# Altium schematic sheet EEPROM.SchDoc
size A4; SheetNumber: 10; SheetTotal: 15
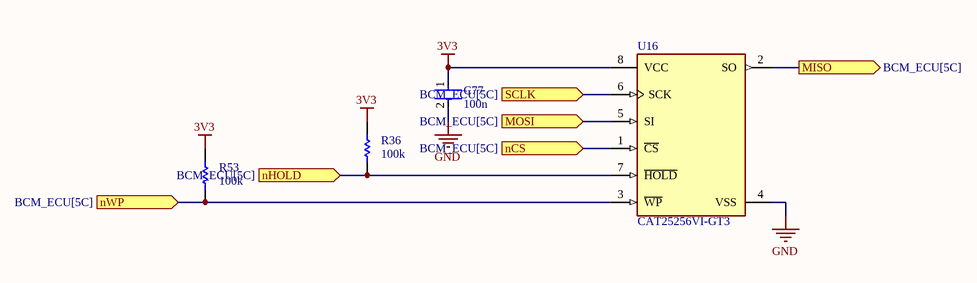
[diagram p0: EEPROM.SchDoc]

## Parts
C77  100n  [FP-0402-L_1_0_0_05-W_0_5-IPC_A]
R36  100k  [R0603B]
R53  100k  [R0603B]
U16  CAT25256VI-GT3  [FP-CAT25256VI-GT3-IPC_C]

## Ports
MISO (out, see BCM_ECU[5C]), MOSI (in, see BCM_ECU[5C]), nCS (in, see BCM_ECU[5C]), nHOLD (in, see BCM_ECU[5C]), nWP (in, see BCM_ECU[5C]), SCLK (in, see BCM_ECU[5C])

## Nets
3V3: C77.1 R36.2 R53.2 U16.8(VCC)
GND: C77.2 U16.4(VSS)
MISO: U16.2(SO) ; port MISO
MOSI: U16.5(SI) ; port MOSI
nCS: U16.1(~{CS}) ; port nCS
nHOLD: R36.1 U16.7(~{HOLD}) ; port nHOLD
nWP: R53.1 U16.3(~{WP}) ; port nWP
SCLK: U16.6(SCK) ; port SCLK

## Library data of the parts
C77 = CMP-001-00058-1: LARGE PADS, 0402 CAP, CHANGE COMMENT TO MATCH REAL P/N; Capacitor Type: Ceramic; Min Operating Temperature: -55°C; Mounting Technology: Surface Mount; Pins: 2; Case/Package: 0402; RoHS Compliant: Yes; Max Operating Temperature: 85°C
R36 R53 = CMP-009-00002-14: Resistor; Value: 10k
U16 = CMP-07117-000003-1: IC EEPROM 256K SPI 20MHZ 8SOIC; Manufacturer: ON Semiconductor; Max Supply Voltage: 5.5V; Standoff Height: 0.1mm; Memory Size: 256Kbits; Nominal Supply Current: 2-4mA; Min Supply Voltage: 1.8V; RoHS: TRUE; Temperature: -40°C to +85°C; Category: IC; Mouser Description: EEPROM Serial-SPI 256K-bit 32K x 8 2.5V/3.3V/5V 8-Pin SOIC N T/R; Lead Free: Yes; Ipc Land Pattern Name: SOIC127P600X155-8; ComponentLink2Description: Datasheet; Digikey Description: IC EEPROM 256K SPI 20MHZ 8SOIC; Memory Type: EEPROM; Manufacturer Part Number: CAT25256VI-GT3; Footprint Url: https://www.onsemi.com/pub/Collateral/751BD.PDF; Interface: SPI; Automotive: No; Device Class L2: Memory; Octopart: https://octopart.com/cat25256vi-gt3-on+semiconductor-10567745; ComponentLink2URL: https://www.onsemi.cn/PowerSolutions/document/CAT25256-D.PDF; Temperature Range Low: -40°C; Temperature Range High: +85°C; Device Class L3: EEPROM; Height: 1.75mm; Frequency: 20MHz; Package: SOIC8; Device Class L1: Integrated Circuits (ICs)